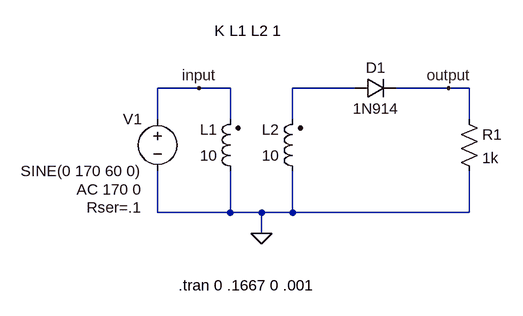
[diagram p0: schematic halfwave_nosmooth.asc]
halfwave_nosmooth.asc, the LTspice schematic file:
Version 4
SHEET 1 880 680
WIRE 208 112 144 112
WIRE 256 112 208 112
WIRE 448 112 352 112
WIRE 592 112 512 112
WIRE 624 112 592 112
WIRE 144 160 144 112
WIRE 256 160 256 112
WIRE 352 160 352 112
WIRE 624 160 624 112
WIRE 144 304 144 240
WIRE 256 304 256 240
WIRE 256 304 144 304
WIRE 304 304 256 304
WIRE 352 304 352 240
WIRE 352 304 304 304
WIRE 624 304 624 240
WIRE 624 304 352 304
WIRE 304 336 304 304
FLAG 304 336 0
FLAG 592 112 output
FLAG 208 112 input
SYMBOL voltage 144 144 M0
WINDOW 123 24 124 Left 2
WINDOW 39 24 152 Left 2
SYMATTR Value2 AC 170 0
SYMATTR SpiceLine Rser=.1
SYMATTR InstName V1
SYMATTR Value SINE(0 170 60 0)
SYMBOL ind2 272 256 R180
WINDOW 0 36 80 Left 2
WINDOW 3 36 40 Left 2
SYMATTR InstName L1
SYMATTR Value 10
SYMATTR Type ind
SYMBOL ind2 368 256 R180
WINDOW 0 36 80 Left 2
WINDOW 3 36 40 Left 2
SYMATTR InstName L2
SYMATTR Value 10
SYMATTR Type ind
SYMBOL diode 448 128 R270
WINDOW 0 32 32 VTop 2
WINDOW 3 0 32 VBottom 2
SYMATTR InstName D1
SYMATTR Value 1N914
SYMBOL res 608 144 R0
SYMATTR InstName R1
SYMATTR Value 1k
TEXT 232 24 Left 2 !K L1 L2 1
TEXT 176 416 Left 2 !.tran 0 .1667 0 .001

The netlist it stands for:
* halfwave_nosmooth.asc
V1 input 0 SINE(0 170 60 0) AC 170 0 Rser=.1
L1 0 input 10
L2 0 N001 10
D1 N001 output 1N914
R1 output 0 1k
.model D D
.lib standard.dio
K L1 L2 1
.tran 0 .1667 0 .001
.backanno
.end

* Results of the author's LTspice run, read from the files saved beside the schematic
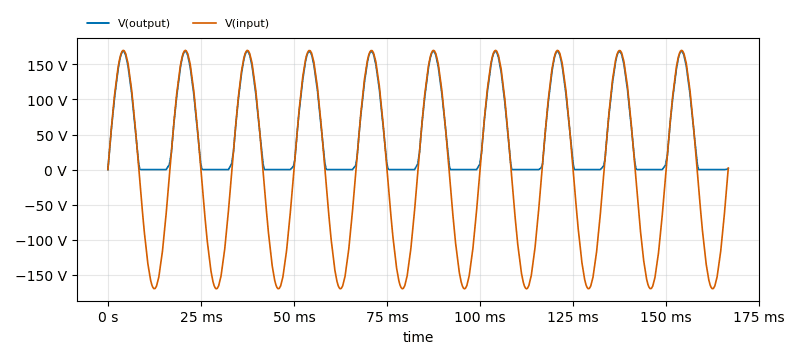
[diagram p1: Transient Analysis of halfwave_nosmooth.asc, plotted from the saved traces]
* Transient Analysis, 1 run:
*   V(output): min -79.87 µV, max 168.6 V, average 53.07 V, rms 83.4 V, last 1.532 V
*   V(input): min -170 V, max 170 V, average -20.47 mV, rms 120.4 V, last 2.136 V